# Altium schematic sheet H-00488 - Top.SchDoc: Top Sheet
size 403 x 281 mm; DocumentNumber: 1; SheetNumber: 1; SheetTotal: 12
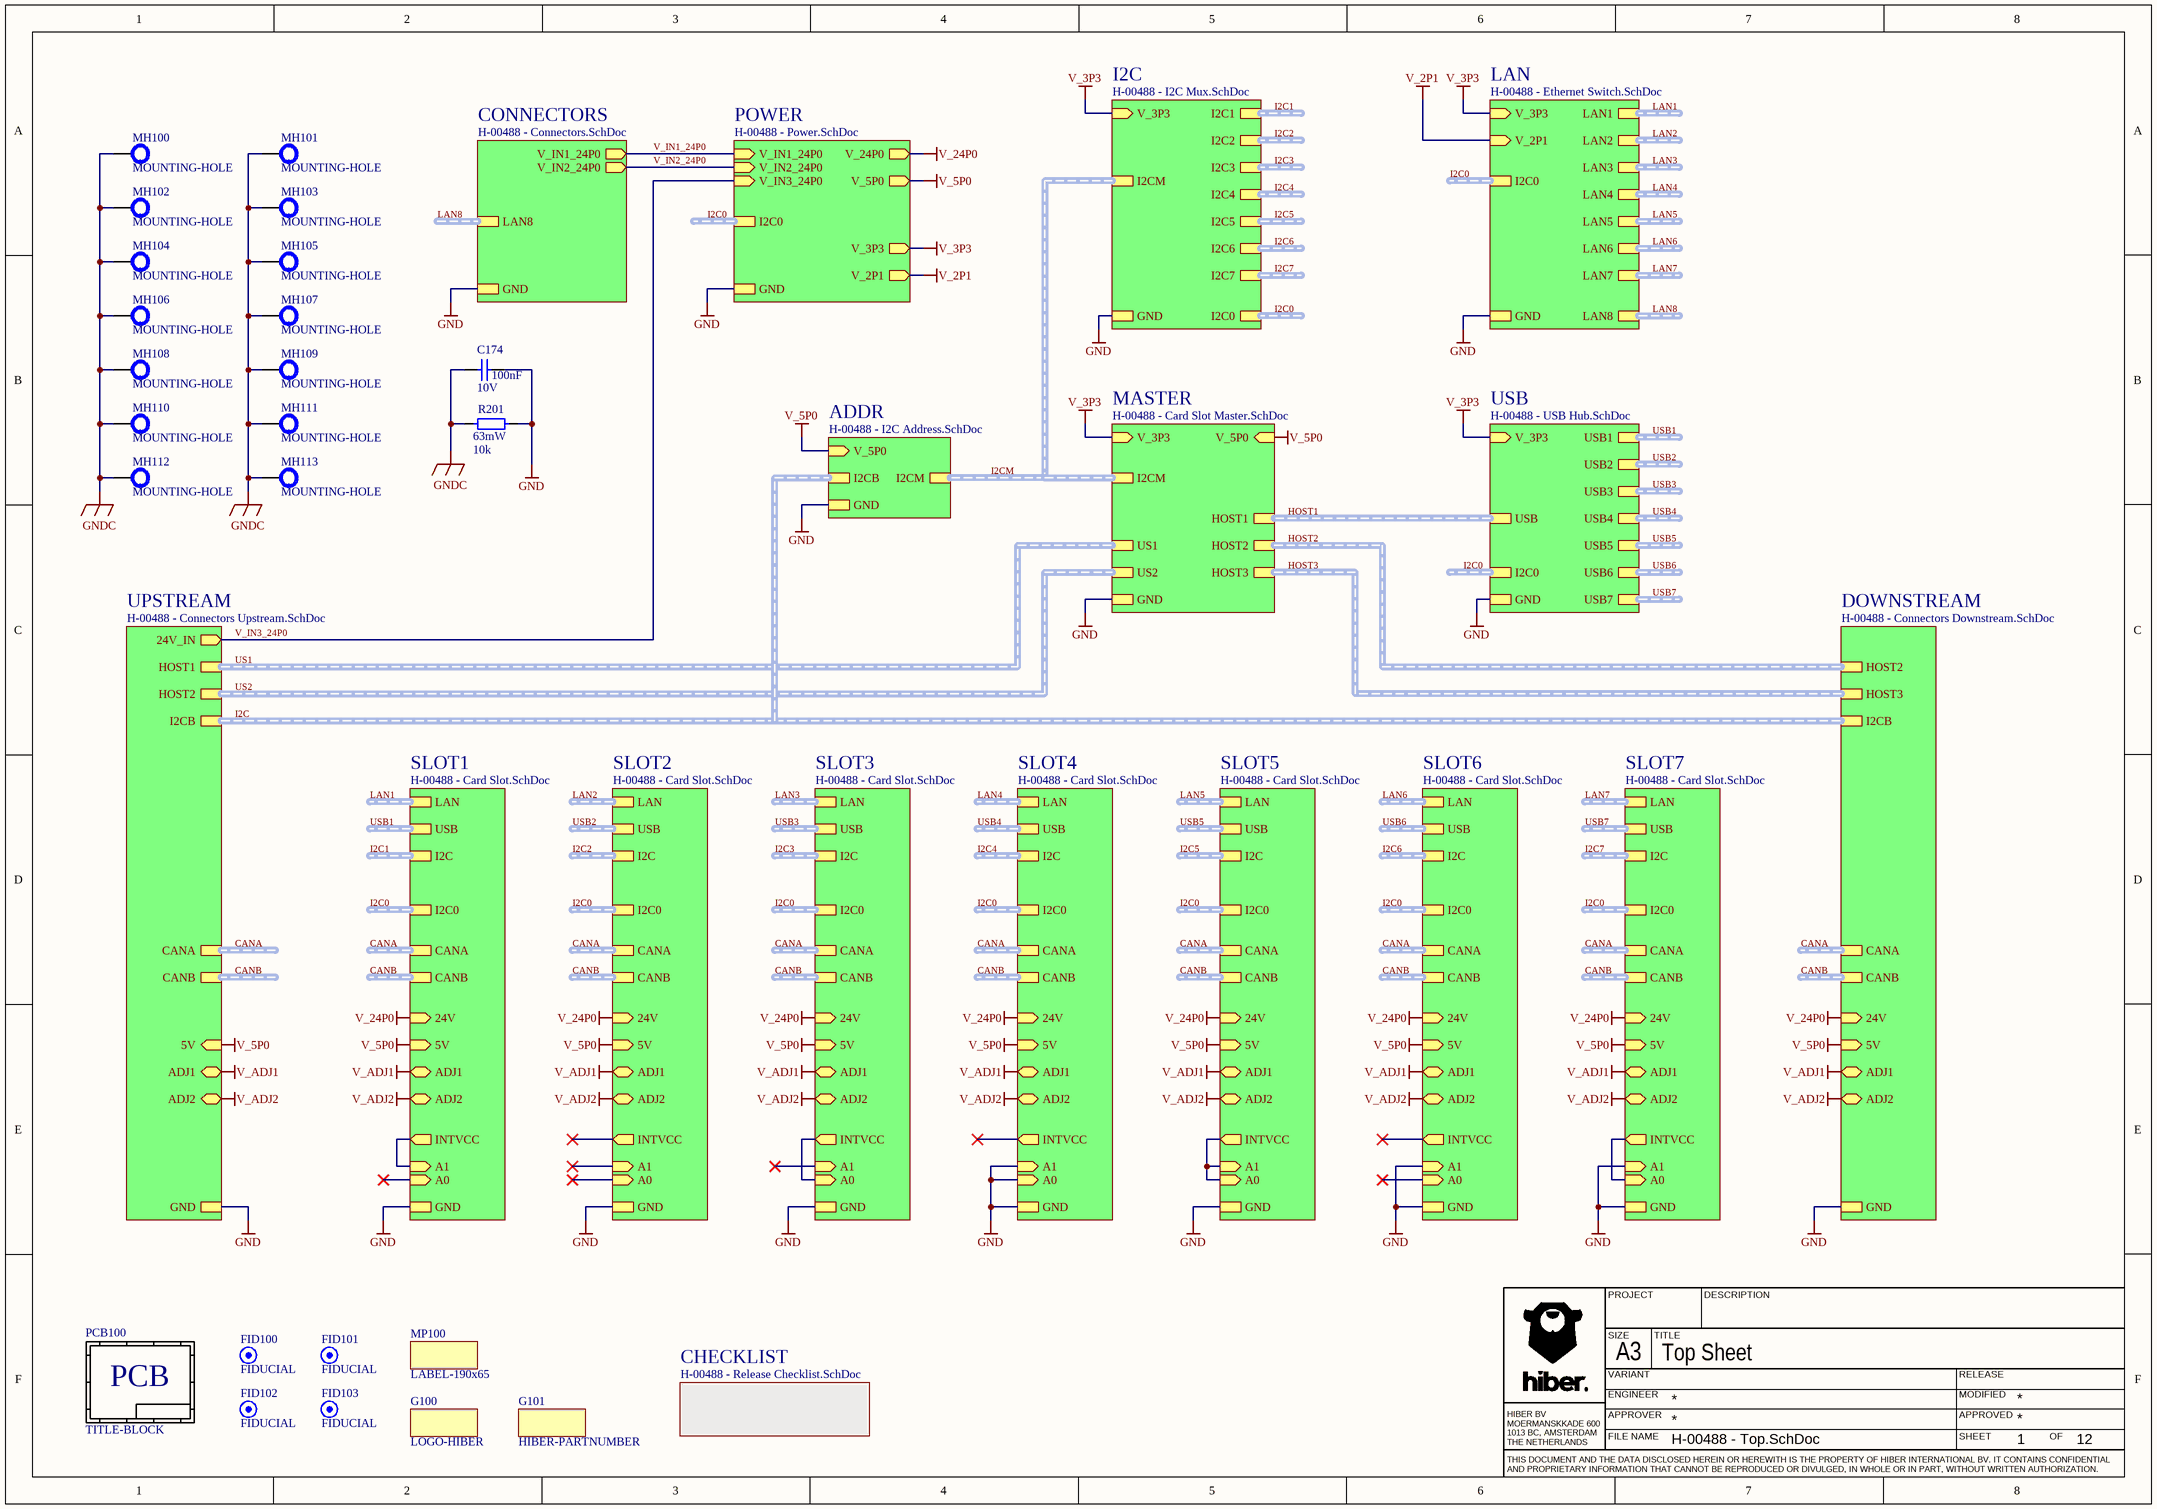
[diagram p0: H-00488 - Top.SchDoc]

## Parts
C174  value 100nF  Rated Voltage: 10V  [CAPC100X50X55L30N]  (hidden comment: C0402C104K8RACTU)
FID100  FIDUCIAL  [FIDUCIAL_075X150]  (no BOM)
FID101  FIDUCIAL  [FIDUCIAL_075X150]  (no BOM)
FID102  FIDUCIAL  [FIDUCIAL_075X150]  (no BOM)
FID103  FIDUCIAL  [FIDUCIAL_075X150]  (no BOM)
G100  LOGO-HIBER  [HIBER_LOGO_COPPER_55x40]  (no BOM)
G101  HIBER-PARTNUMBER  [HIBER_PNSN_COPPER]  (no BOM)
MH100  MOUNTING-HOLE  [MTGP510H260V8H25]  (no BOM)
MH101  MOUNTING-HOLE  [MTGP510H260V8H25]  (no BOM)
MH102  MOUNTING-HOLE  [MTGP510H260V8H25]  (no BOM)
MH103  MOUNTING-HOLE  [MTGP510H260V8H25]  (no BOM)
MH104  MOUNTING-HOLE  [MTGP510H260V8H25]  (no BOM)
MH105  MOUNTING-HOLE  [MTGP510H260V8H25]  (no BOM)
MH106  MOUNTING-HOLE  [MTGP510H260V8H25]  (no BOM)
MH107  MOUNTING-HOLE  [MTGP510H260V8H25]  (no BOM)
MH108  MOUNTING-HOLE  [MTGP510H260V8H25]  (no BOM)
MH109  MOUNTING-HOLE  [MTGP510H260V8H25]  (no BOM)
MH110  MOUNTING-HOLE  [MTGP510H260V8H25]  (no BOM)
MH111  MOUNTING-HOLE  [MTGP510H260V8H25]  (no BOM)
MH112  MOUNTING-HOLE  [MTGP510H260V8H25]  (no BOM)
MH113  MOUNTING-HOLE  [MTGP510H260V8H25]  (no BOM)
MP100  LABEL-190x65  [LABEL_200X65_OVERLAY]
PCB100  TITLE-BLOCK  [TITLEBLOCK-A4]
R201  value 10k  Rated Power: 63mW  [RESC100X50X40L25N]  (hidden comment: CRCW040210K0FKED)

## Sub-sheets
ADDR = H-00488 - I2C Address.SchDoc: GND, V_5P0 (in), I2CM (harness I2C_ADDR), I2CB (harness I2C_BACKPLANE)
CHECKLIST = H-00488 - Release Checklist.SchDoc: no entries
CONNECTORS = H-00488 - Connectors.SchDoc: GND, LAN8 (harness LAN_100BASE_TX_LED), V_IN1_24P0 (out), V_IN2_24P0 (out)
DOWNSTREAM = H-00488 - Connectors Downstream.SchDoc: ADJ1 (bidir), 24V (in), ADJ2 (bidir), I2CB (harness I2C_MASTER), HOST3 (harness USB), HOST2 (harness USB), CANA (harness CAN), CANB (harness CAN), GND, 5V (in)
I2C = H-00488 - I2C Mux.SchDoc: GND, V_3P3 (in), I2C1 (harness I2C), I2C2 (harness I2C), I2C3 (harness I2C), I2C4 (harness I2C), I2C5 (harness I2C), I2C6 (harness I2C), I2C7 (harness I2C), I2C0 (harness I2C_ADDR), I2CM (harness I2C_ADDR)
LAN = H-00488 - Ethernet Switch.SchDoc: GND, V_3P3 (in), LAN1 (harness LAN_100BASE_TX), LAN2 (harness LAN_100BASE_TX), LAN3 (harness LAN_100BASE_TX), LAN4 (harness LAN_100BASE_TX), LAN5 (harness LAN_100BASE_TX), LAN6 (harness LAN_100BASE_TX), LAN7 (harness LAN_100BASE_TX), LAN8 (harness LAN_100BASE_TX_LED), I2C0 (harness I2C_ADDR), V_2P1 (in)
MASTER = H-00488 - Card Slot Master.SchDoc: HOST2 (harness USB), HOST1 (harness USB), HOST3 (harness USB), I2CM (harness I2C_ADDR), US2 (harness USB), US1 (harness USB), GND, V_3P3 (in), V_5P0 (in)
POWER = H-00488 - Power.SchDoc: GND, V_3P3 (out), V_5P0 (out), V_24P0 (out), V_IN1_24P0 (in), I2C0 (harness I2C_ADDR), V_IN3_24P0 (in), V_2P1 (out), V_IN2_24P0 (in)
SLOT1 = H-00488 - Card Slot.SchDoc: I2C (harness I2C), CANA (harness CAN), LAN (harness LAN_100BASE_TX), USB (harness USB), ADJ1 (bidir), 24V (in), CANB (harness CAN), 5V (in), ADJ2 (bidir), GND, I2C0 (harness I2C_ADDR), INTVCC (out), A1 (in), A0 (in)
SLOT2 = H-00488 - Card Slot.SchDoc: I2C (harness I2C), CANA (harness CAN), LAN (harness LAN_100BASE_TX), USB (harness USB), ADJ1 (bidir), 24V (in), CANB (harness CAN), 5V (in), ADJ2 (bidir), GND, I2C0 (harness I2C_ADDR), INTVCC (out), A1 (in), A0 (in)
SLOT3 = H-00488 - Card Slot.SchDoc: I2C (harness I2C), CANA (harness CAN), LAN (harness LAN_100BASE_TX), USB (harness USB), ADJ1 (bidir), 24V (in), CANB (harness CAN), 5V (in), ADJ2 (bidir), GND, I2C0 (harness I2C_ADDR), INTVCC (out), A1 (in), A0 (in)
SLOT4 = H-00488 - Card Slot.SchDoc: I2C (harness I2C), CANA (harness CAN), LAN (harness LAN_100BASE_TX), USB (harness USB), ADJ1 (bidir), 24V (in), CANB (harness CAN), 5V (in), ADJ2 (bidir), GND, I2C0 (harness I2C_ADDR), INTVCC (out), A1 (in), A0 (in)
SLOT5 = H-00488 - Card Slot.SchDoc: I2C (harness I2C), CANA (harness CAN), LAN (harness LAN_100BASE_TX), USB (harness USB), ADJ1 (bidir), 24V (in), CANB (harness CAN), 5V (in), ADJ2 (bidir), GND, I2C0 (harness I2C_ADDR), INTVCC (out), A1 (in), A0 (in)
SLOT6 = H-00488 - Card Slot.SchDoc: I2C (harness I2C), CANA (harness CAN), LAN (harness LAN_100BASE_TX), USB (harness USB), ADJ1 (bidir), 24V (in), CANB (harness CAN), 5V (in), ADJ2 (bidir), GND, I2C0 (harness I2C_ADDR), INTVCC (out), A1 (in), A0 (in)
SLOT7 = H-00488 - Card Slot.SchDoc: I2C (harness I2C), CANA (harness CAN), LAN (harness LAN_100BASE_TX), USB (harness USB), ADJ1 (bidir), 24V (in), CANB (harness CAN), 5V (in), ADJ2 (bidir), GND, I2C0 (harness I2C_ADDR), INTVCC (out), A1 (in), A0 (in)
UPSTREAM = H-00488 - Connectors Upstream.SchDoc: ADJ1 (bidir), 24V_IN (out), ADJ2 (bidir), I2CB (harness I2C_MASTER), HOST1 (harness USB), HOST2 (harness USB), CANA (harness CAN), CANB (harness CAN), GND, 5V (in)
USB = H-00488 - USB Hub.SchDoc: GND, V_3P3 (in), USB1 (harness USB), USB2 (harness USB), USB3 (harness USB), USB4 (harness USB), USB5 (harness USB), USB6 (harness USB), USB7 (harness USB), USB (harness USB), I2C0 (harness I2C_ADDR)

## Nets
GND: C174.2 R201.2 ; sheet LAN/GND, sheet DOWNSTREAM/GND, sheet SLOT1/GND, sheet SLOT2/GND, sheet SLOT3/GND, sheet SLOT4/GND, sheet SLOT4/A1, sheet SLOT4/A0, sheet SLOT5/GND, sheet USB/GND, sheet SLOT6/GND, sheet SLOT6/A1, sheet SLOT7/GND, sheet SLOT7/A1, sheet I2C/GND, sheet UPSTREAM/GND, sheet MASTER/GND, sheet POWER/GND, sheet CONNECTORS/GND, sheet ADDR/GND
GNDC: C174.1 MH100.1 MH101.1 MH102.1 MH103.1 MH104.1 MH105.1 MH106.1 MH107.1 MH108.1 MH109.1 MH110.1 MH111.1 MH112.1 MH113.1 R201.1
V_2P1: sheet LAN/V_2P1, sheet POWER/V_2P1
V_3P3: sheet LAN/V_3P3, sheet USB/V_3P3, sheet I2C/V_3P3, sheet MASTER/V_3P3, sheet POWER/V_3P3
V_5P0: sheet DOWNSTREAM/5V, sheet SLOT1/5V, sheet SLOT2/5V, sheet SLOT3/5V, sheet SLOT4/5V, sheet SLOT5/5V, sheet SLOT6/5V, sheet SLOT7/5V, sheet UPSTREAM/5V, sheet MASTER/V_5P0, sheet POWER/V_5P0, sheet ADDR/V_5P0
V_24P0: sheet DOWNSTREAM/24V, sheet SLOT1/24V, sheet SLOT2/24V, sheet SLOT3/24V, sheet SLOT4/24V, sheet SLOT5/24V, sheet SLOT6/24V, sheet SLOT7/24V, sheet POWER/V_24P0
V_ADJ1: sheet DOWNSTREAM/ADJ1, sheet SLOT1/ADJ1, sheet SLOT2/ADJ1, sheet SLOT3/ADJ1, sheet SLOT4/ADJ1, sheet SLOT5/ADJ1, sheet SLOT6/ADJ1, sheet SLOT7/ADJ1, sheet UPSTREAM/ADJ1
V_ADJ2: sheet DOWNSTREAM/ADJ2, sheet SLOT1/ADJ2, sheet SLOT2/ADJ2, sheet SLOT3/ADJ2, sheet SLOT4/ADJ2, sheet SLOT5/ADJ2, sheet SLOT6/ADJ2, sheet SLOT7/ADJ2, sheet UPSTREAM/ADJ2
V_IN1_24P0: sheet POWER/V_IN1_24P0, sheet CONNECTORS/V_IN1_24P0
V_IN2_24P0: sheet POWER/V_IN2_24P0, sheet CONNECTORS/V_IN2_24P0
V_IN3_24P0: sheet UPSTREAM/24V_IN, sheet POWER/V_IN3_24P0
(unnamed): sheet SLOT1/INTVCC, sheet SLOT1/A1
(unnamed): sheet SLOT3/INTVCC, sheet SLOT3/A0
(unnamed): sheet SLOT5/INTVCC, sheet SLOT5/A1, sheet SLOT5/A0
(unnamed): sheet SLOT7/INTVCC, sheet SLOT7/A0

## Buses and harness runs
harness CANA = sheet DOWNSTREAM/CANA
harness CANA = sheet SLOT1/CANA
harness CANA = sheet SLOT2/CANA
harness CANA = sheet SLOT3/CANA
harness CANA = sheet SLOT4/CANA
harness CANA = sheet SLOT5/CANA
harness CANA = sheet SLOT6/CANA
harness CANA = sheet SLOT7/CANA
harness CANA = sheet UPSTREAM/CANA
harness CANB = sheet DOWNSTREAM/CANB
harness CANB = sheet SLOT1/CANB
harness CANB = sheet SLOT2/CANB
harness CANB = sheet SLOT3/CANB
harness CANB = sheet SLOT4/CANB
harness CANB = sheet SLOT5/CANB
harness CANB = sheet SLOT6/CANB
harness CANB = sheet SLOT7/CANB
harness CANB = sheet UPSTREAM/CANB
harness HOST1 = sheet MASTER/HOST1 = sheet USB/USB
harness HOST2 = sheet DOWNSTREAM/HOST2 = sheet MASTER/HOST2
harness HOST3 = sheet DOWNSTREAM/HOST3 = sheet MASTER/HOST3
harness I2C0 = sheet I2C/I2C0
harness I2C0 = sheet LAN/I2C0
harness I2C0 = sheet POWER/I2C0
harness I2C0 = sheet SLOT1/I2C0
harness I2C0 = sheet SLOT2/I2C0
harness I2C0 = sheet SLOT3/I2C0
harness I2C0 = sheet SLOT4/I2C0
harness I2C0 = sheet SLOT5/I2C0
harness I2C0 = sheet SLOT6/I2C0
harness I2C0 = sheet SLOT7/I2C0
harness I2C0 = sheet USB/I2C0
harness I2C1 = sheet I2C/I2C1
harness I2C1 = sheet SLOT1/I2C
harness I2C2 = sheet I2C/I2C2
harness I2C2 = sheet SLOT2/I2C
harness I2C3 = sheet I2C/I2C3
harness I2C3 = sheet SLOT3/I2C
harness I2C4 = sheet I2C/I2C4
harness I2C4 = sheet SLOT4/I2C
harness I2C5 = sheet I2C/I2C5
harness I2C5 = sheet SLOT5/I2C
harness I2C6 = sheet I2C/I2C6
harness I2C6 = sheet SLOT6/I2C
harness I2C7 = sheet I2C/I2C7
harness I2C7 = sheet SLOT7/I2C
harness I2C = sheet ADDR/I2CB = sheet DOWNSTREAM/I2CB = sheet UPSTREAM/I2CB
harness I2CM = sheet ADDR/I2CM = sheet I2C/I2CM = sheet MASTER/I2CM
harness LAN1 = sheet LAN/LAN1
harness LAN1 = sheet SLOT1/LAN
harness LAN2 = sheet LAN/LAN2
harness LAN2 = sheet SLOT2/LAN
harness LAN3 = sheet LAN/LAN3
harness LAN3 = sheet SLOT3/LAN
harness LAN4 = sheet LAN/LAN4
harness LAN4 = sheet SLOT4/LAN
harness LAN5 = sheet LAN/LAN5
harness LAN5 = sheet SLOT5/LAN
harness LAN6 = sheet LAN/LAN6
harness LAN6 = sheet SLOT6/LAN
harness LAN7 = sheet LAN/LAN7
harness LAN7 = sheet SLOT7/LAN
harness LAN8 = sheet CONNECTORS/LAN8
harness LAN8 = sheet LAN/LAN8
harness US1 = sheet MASTER/US1 = sheet UPSTREAM/HOST1
harness US2 = sheet MASTER/US2 = sheet UPSTREAM/HOST2
harness USB1 = sheet SLOT1/USB
harness USB1 = sheet USB/USB1
harness USB2 = sheet SLOT2/USB
harness USB2 = sheet USB/USB2
harness USB3 = sheet SLOT3/USB
harness USB3 = sheet USB/USB3
harness USB4 = sheet SLOT4/USB
harness USB4 = sheet USB/USB4
harness USB5 = sheet SLOT5/USB
harness USB5 = sheet USB/USB5
harness USB6 = sheet SLOT6/USB
harness USB6 = sheet USB/USB6
harness USB7 = sheet SLOT7/USB
harness USB7 = sheet USB/USB7

## Notes on the sheet
- PROJECT
- DESCRIPTION
- SIZE
- ENGINEER
- VARIANT
- A3
- TITLE
- MODIFIED
- RELEASE
- HIBER BV
  MOERMANSKKADE 600
  1013 BC, AMSTERDAM
  THE NETHERLANDS
- FILE NAME
- APPROVER
- SHEET
- APPROVED
- OF
- THIS DOCUMENT AND THE DATA DISCLOSED HEREIN OR HEREWITH IS THE PROPERTY OF HIBER INTERNATIONAL BV. IT CONTAINS CONFIDENTIAL AND PROPRIETARY INFORMATION THAT CANNOT BE REPRODUCED OR DIVULGED, IN WHOLE OR IN PART, WITHOUT WRITTEN AUTHORIZATION.
- (in symbol CMP-00011-3) PCB

## Library data of the parts
C174 = CMP-00367-3: CAP Standard 0402 (1005) 100,0nF 10V X7R (Standard); Type: Ceramic; Tolerance: 10%; Termination Finish: 100% Matte Sn; Qualification: Standard; RoHS: Yes; Mount: SMT; Case/Package: 0402 (1005); Failure Rate: N/A; Pins: 2; Dielectric: X7R
FID100-FID103 = CMP-00519-1
G100 = CMP-00553-6: Hiber Logo
G101 = CMP-00558-6: Hiber Fabrication Partnumber
MH100-MH113 = CMP-00668-11: Mounting Hole
MP100 = CMP-00552-5: Label Placeholder 0.75" x 0.25" (Zebra 10015764)
PCB100 = CMP-00011-3: Title Block and PCB BOM Line Item
R201 = CMP-00294-7: RES Standard Thick Film 0402 10K0 ±1% 0,063W; Qualification: Automotive; Rated Voltage: 50V; Mount: Surface Mount; Termination Finish: Pure tin solder contacts on Ni barrier layer; Tolerance: 1%; Type: Standard Thick Film; Case/Package: 0402 (1005); Failure Rate: N/A; Pins: 2; RoHS: Yes